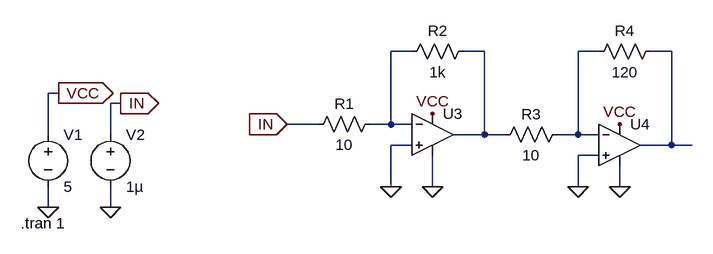
[diagram p0: schematic Amp.asc]
Amp.asc, the LTspice schematic file:
Version 4
SHEET 1 880 680
WIRE 128 32 96 32
WIRE 240 32 208 32
WIRE 416 32 384 32
WIRE 528 32 496 32
WIRE -416 96 -432 96
WIRE -320 112 -336 112
WIRE -16 144 -64 144
WIRE 96 144 96 32
WIRE 96 144 64 144
WIRE 128 144 96 144
WIRE -432 160 -432 96
WIRE -336 160 -336 112
WIRE 240 160 240 32
WIRE 240 160 192 160
WIRE 272 160 240 160
WIRE 384 160 384 32
WIRE 384 160 352 160
WIRE 416 160 384 160
WIRE 128 176 96 176
WIRE 528 176 528 32
WIRE 528 176 480 176
WIRE 560 176 528 176
WIRE 416 192 384 192
WIRE 96 240 96 176
WIRE 160 240 160 192
WIRE 384 240 384 192
WIRE 448 240 448 208
WIRE -432 272 -432 240
WIRE -336 272 -336 240
FLAG 96 240 0
FLAG -64 144 IN
IOPIN -64 144 In
FLAG 384 240 0
FLAG -336 272 0
FLAG -432 272 0
FLAG -416 96 VCC
IOPIN -416 96 Out
FLAG -320 112 IN
IOPIN -320 112 Out
FLAG 160 240 0
FLAG 448 240 0
FLAG 160 128 VCC
FLAG 448 144 VCC
SYMBOL res 80 128 R90
WINDOW 0 0 56 VBottom 2
WINDOW 3 32 56 VTop 2
SYMATTR InstName R1
SYMATTR Value 10
SYMBOL res 112 48 R270
WINDOW 0 32 56 VTop 2
WINDOW 3 0 56 VBottom 2
SYMATTR InstName R2
SYMATTR Value 1k
SYMBOL res 368 144 R90
WINDOW 0 0 56 VBottom 2
WINDOW 3 32 56 VTop 2
SYMATTR InstName R3
SYMATTR Value 10
SYMBOL res 512 16 R90
WINDOW 0 0 56 VBottom 2
WINDOW 3 32 56 VTop 2
SYMATTR InstName R4
SYMATTR Value 120
SYMBOL voltage -432 144 R0
WINDOW 123 0 0 Left 0
WINDOW 39 0 0 Left 0
SYMATTR InstName V1
SYMATTR Value 5
SYMBOL voltage -336 144 R0
WINDOW 123 0 0 Left 0
WINDOW 39 0 0 Left 0
SYMATTR InstName V2
SYMATTR Value 1µ
SYMBOL Opamps\\UniversalOpAmp 160 160 R0
SYMATTR InstName U3
SYMBOL Opamps\\UniversalOpAmp 448 176 R0
SYMATTR InstName U4
TEXT -474 296 Left 2 !.tran 1

The netlist it stands for:
* Amp.asc
R1 N001 IN 10
R2 N001 N002 1k
R3 N003 N002 10
R4 N004 N003 120
V1 VCC 0 5
V2 IN 0 1µ
XU3 0 N001 VCC 0 N002 level1 Avol=1Meg GBW=10Meg Vos=0 En=0 Enk=0 In=0 Ink=0 Rin=500Meg  ; pins In+ In- V+ V- OUT
XU4 0 N003 VCC 0 N004 level1 Avol=1Meg GBW=10Meg Vos=0 En=0 Enk=0 In=0 Ink=0 Rin=500Meg  ; pins In+ In- V+ V- OUT
.tran 1
.lib UniversalOpAmp1.lib
.backanno
.end